# EAGLE design WeMos-Lora (EAGLE 8.1.0)
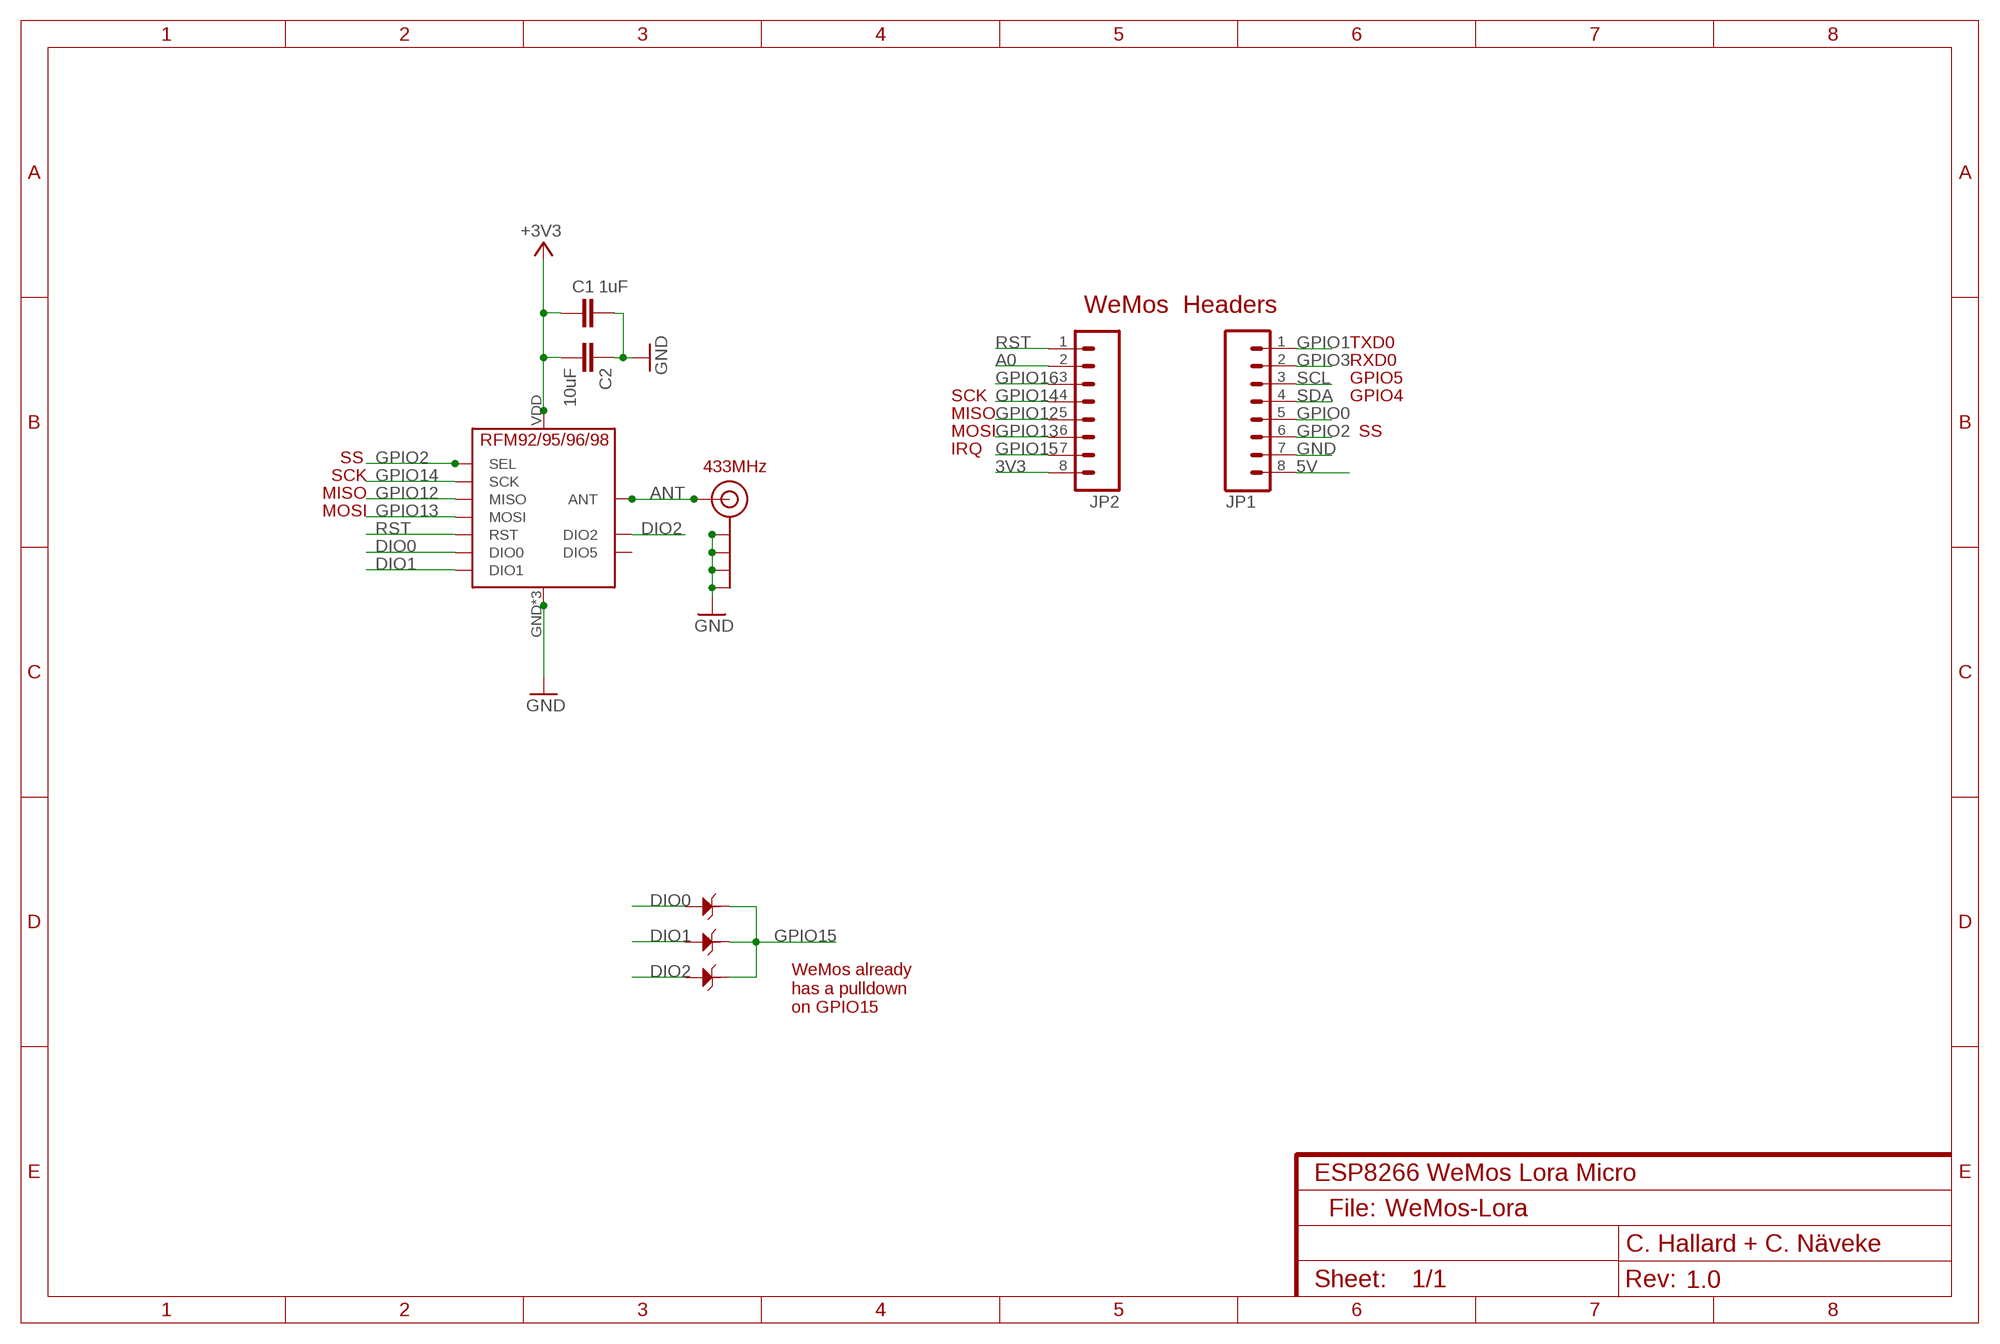
[diagram p0: schematic, sheet 1]
NAME (FRAME-A4L): CNAME: ESP8266 WeMos Lora Micro; CREVISION: 1.0; DESIGNER: C. Hallard + C. Näveke

## Parts
C1  1uF  CAP0805-CAP-LARGEPADS  [0805-CAP-LARGEPADS]
C2  10uF  CAP0805-CAP-LARGEPADS  [0805-CAP-LARGEPADS]
D2  1N4148  D-ESD-2P-CESD5V0D1  [SOD123-2.7X1.6]
D3  1N4148  D-ESD-2P-CESD5V0D1  [SOD123-2.7X1.6]
D4  1N4148  D-ESD-2P-CESD5V0D1  [SOD123-2.7X1.6]
J$2  ANTENNATINY  [SMA_UFL_PAD_TINY]
JP1  M08NO_SILK_FEMALE_PTH  [1X08_NO_SILK]
JP2  M08NO_SILK_FEMALE_PTH  [1X08_NO_SILK]
U$5  RFM95  [RFM95]

## Nets
3V3: C1.2 C2.2 JP2.8 U$5.VDD(VCC) ; supply symbol labelled +3V3
5V: JP1.8
A0: JP2.2
ANT: J$2.ANT1(SIGNAL) J$2.ANT2(SIGNAL) J$2.ANT3(SIGNAL) U$5.ANT
DIO0: D2.1 U$5.DIO0
DIO1: D3.1 U$5.DIO1
DIO2: D4.1 U$5.DIO2
GND: C1.1 C2.1 J$2.GND1(GND) J$2.GND2(GND) J$2.GND3(GND) J$2.GND4(GND) JP1.7 U$5.GND U$5.GND1(GND) U$5.GND2(GND)
GPIO0: JP1.5
GPIO1: JP1.1
GPIO2: JP1.6 U$5.NSS(SEL)
GPIO3: JP1.2
GPIO12: JP2.5 U$5.MISO
GPIO13: JP2.6 U$5.MOSI
GPIO14: JP2.4 U$5.SCK
GPIO15: D2.2 D3.2 D4.2 JP2.7
GPIO16: JP2.3
RST: JP2.1 U$5.RST
SCL: JP1.3
SDA: JP1.4
Unconnected: U$5.DIO5

## Notes on the sheet
- WeMos  Headers
- TXD0
- RXD0
- GPIO5
- SCK | GPIO4
- MISO
- MOSI | SS
- IRQ
- SS
- 433MHz
- SCK
- MISO
- MOSI
- WeMos already
  has a pulldown
  on GPIO15
- File:

## Library data of the parts
C1 C2 = _c2h:CAP: Capacitor Standard 0603 ceramic capacitor, and 0.1" leaded capacitor.
D2-D4 = Seeed-Discrete:D-ESD-2P: Diodes for Protectiong against ESD
J$2 = _c2h:ANTENNA: SMA Antenna Connector End launch SMA connector. The paste layer has been removed so that the connector can be hand soldered onto the board after reflow.
JP1 JP2 = SparkFun-Connectors:M08: Header 8 Standard 8-pin 0.1" header. Use with straight break away headers (SKU : PRT-00116), right angle break away headers (PRT-00553), swiss pins (PRT-00743), machine pins (PRT-00117), and female headers (PRT-00115).; PROD_ID: CONN-08438
U$5 = _c2h:RFM95

## Net classes
0 default: width 0.203 mm, drill 0.356 mm, clearance 0.152 mm
1 power: width 0.203 mm, clearance 0.152 mm

## Board
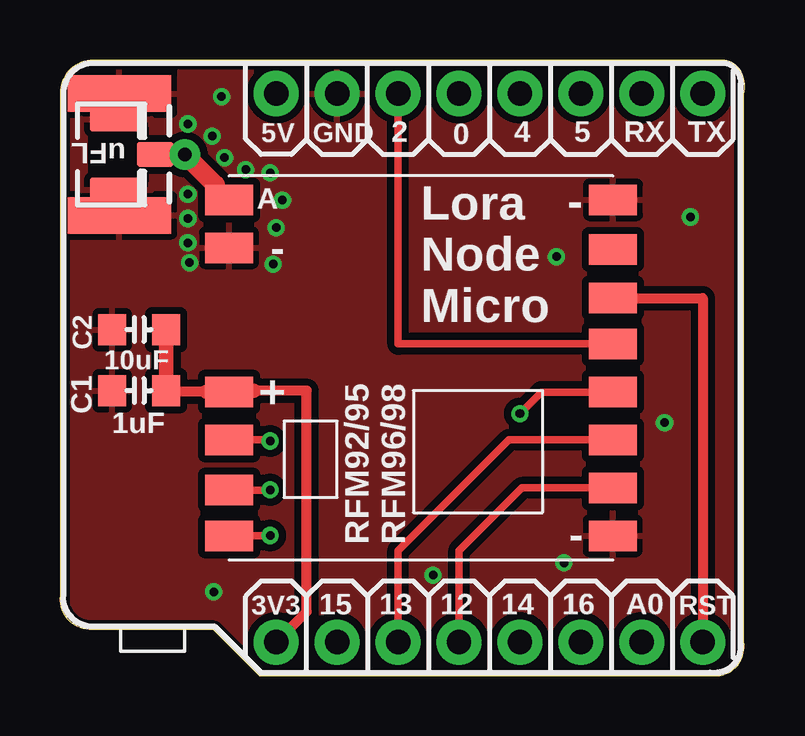
[diagram p1: board, top side]
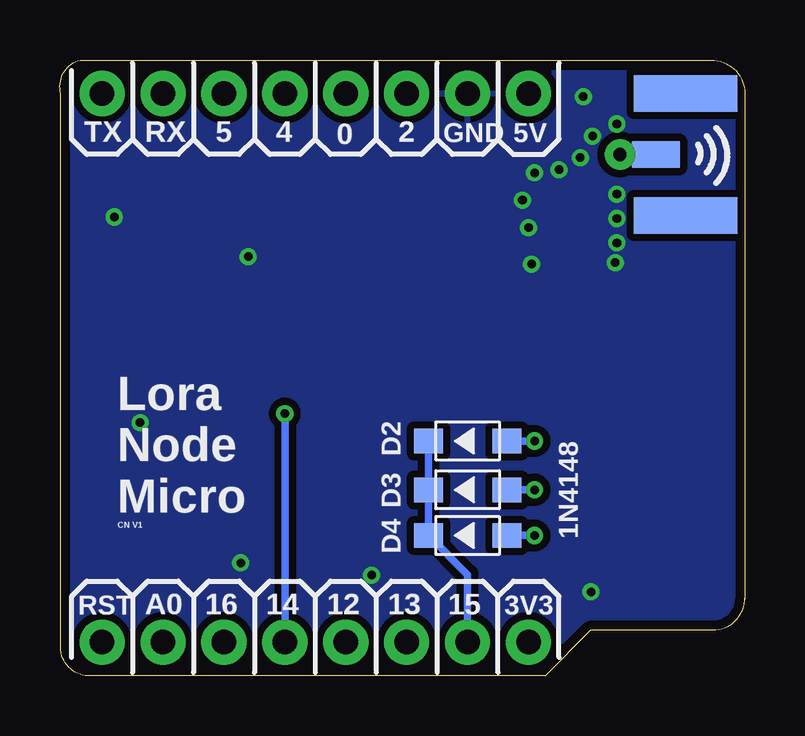
[diagram p2: board, bottom side, seen from below]

Size 28.55 x 25.65 mm. Coordinates in mm from the lower left corner, seen from the top.
Outline: 1.4,25.65 27.72,25.65 arc-90 28.51,24.26 28.51,1.4 arc-90 27.5,0 8.32,0 6.41,1.91 1.33,1.91 arc-90 0,3.24
Outline: 1.4,25.65 1.37,25.65
Outline: 0,3.24 0,24.26 arc-90 1.4,25.65
Outline: 0,3.24 0,3.17
Copper layers (1*16): Top 0.0356mm / dielectric 1.5011mm / Bottom 0.0356mm
Design rules "PCBs_io *": minimum track width 6mil, minimum drill 13mil, track to track 6mil, track to pad 6mil, pad to pad 6mil, via to via 6mil, smd to smd 6mil, copper to edge 15mil, drill to drill 6mil, minimum pad ring 7mil, minimum via ring 7mil, stop-mask expansion 3mil, vias tented up to drill 40mil, thermal gap 10mil

### Footprints (pad centres in the part's own frame; a part is rotated, then mirrored left to right if it is on the bottom)
0805-CAP-LARGEPADS = smd 1.156 x 1.3: 1 -1.127,0; 2 1.127,0
SOD123-2.7X1.6 = smd 1.2 x 1.02: 1 -1.635,0; 2 1.635,0
SMA_UFL_PAD_TINY = smd 1.524 x 1.016: ANT1 -3.843,0 | drill 0.559 pad 1.27: ANT2 -5.08,0 | smd 2.032 x 1.143 bottom: ANT3 -3.589,0 | smd 2.2 x 1.016: GND1 -2.223,1.47; GND2 -2.223,-1.47 | smd 4.318 x 1.524: GND3 -2.349,-2.54; GND4 -2.349,2.54 | smd 4.318 x 1.524 bottom: GND5 -2.349,2.54; GND6 -2.349,-2.54
1X08_NO_SILK = drill 1.016 pad 1.88: 1 0,0; 2 2.54,0; 3 5.08,0; 4 7.62,0; 5 10.16,0; 6 12.7,0; 7 15.24,0; 8 17.78,0
RFM95 = smd 2 x 1.27: ANT 5.777,-7; DIO0 5.777,3; DIO1 5.779,5.095; DIO2 5.779,7; DIO5 -10.225,-4.936; GND 5.777,-5; GND1 -10.223,7; GND2 -10.23,-7; MISO -10.23,5; MOSI -10.225,3; NSS -10.223,-1; RST -10.223,-2.905; SCK -10.23,1.012; VDD 5.777,1

### Placement (x,y rotation side)
C1  3.3,11.87 0 top
C2  3.3,14.41 0 top
D2  11.56,9.78 180 bottom
D3  11.56,7.75 180 bottom
D4  11.56,5.84 180 bottom
J$2  0.13,21.72 180 top
JP1  26.8,24.26 180 top
JP2  26.8,1.4 180 top
U$5  12.83,12.83 180 top

### Tracks (layer width: path | path; a pad name or v marks a point on that pad's centre or on a via)
3V3
  Top 0.406: JP2.8 10.29,2.67 10.29,11.88 7.05,11.88 U$5.VDD 4.43,11.83 C1.2
  Top 0.61: 8.06,11.88 6.11,11.83 U$5.VDD | C1.2 C2.2
ANT
  Top 0.61: U$5.ANT 6.46,19.83 | J$2.ANT1 J$2.ANT2
  Top 0.813: 6.46,19.83 6.46,20.46 J$2.ANT2
  Bottom 0.61: J$2.ANT3 J$2.ANT2
DIO0  (via drill 0.36 pad 0.61)
  Top 0.305: U$5.DIO0 8.71,9.83 v8.76,9.78
  Bottom 0.305: D2.1 v8.76,9.78
DIO1  (via drill 0.36 pad 0.61)
  Top 0.305: 7.03,7.75 U$5.DIO1 8.75,7.73 v8.76,7.75
  Bottom 0.305: D3.1 v8.76,7.75
DIO2  (via drill 0.36 pad 0.61)
  Top 0.305: U$5.DIO2 8.75,5.83 v8.76,5.84
  Bottom 0.305: D4.1 v8.76,5.84
GND  (via drill 0.36 pad 0.71)
  other vias: 25.21,10.54 6.41,3.49 6.73,24.13 9.27,19.81 8.89,17.14 6.35,22.48 6.86,21.59 5.33,20.07 5.33,19.05 5.33,18.03 5.33,22.99 15.56,4.19 21.02,4.7 26.29,19.11 7.75,21.08 8.76,20.95 9.02,18.67 5.4,17.21 20.7,17.46
  pour Bottom (isolate 0.305): 29.65,26.8 29.65,-1.14 -1.14,-1.14 -1.14,26.8
  pour Top (isolate 0.305): -0.51,26.16 29.02,26.16 29.02,-0.51 -0.51,-0.51
GPIO2
  Top 0.305: 23.05,13.78 U$5.NSS 14.1,13.83 JP1.6
GPIO12
  Top 0.305: JP2.5 16.64,5.21 19.26,7.83 U$5.MISO
GPIO13
  Top 0.305: JP2.6 14.1,5.21 18.72,9.83 U$5.MOSI
GPIO14  (via drill 0.36 pad 0.71)
  Top 0.305: U$5.SCK 20.07,11.82 v19.18,10.92
  Bottom 0.305: v19.18,10.92 JP2.4
GPIO15
  Bottom 0.305: D2.2 D3.2 D4.2 11.56,4.21 JP2.7
RST
  Top 0.406: U$5.RST 26.8,15.73 JP2.1

### Text on the board
tNames: 5V | GND | 2 | 0 | 4 | 5 | RX | TX | Lora / Node / Micro | RFM92/95 / RFM96/98 | 3V3 | 15 | 13 | 12 | 14 | 16 | A0 | RST
bNames: 5V | GND | 2 | 0 | 4 | 5 | RX | TX | Lora / Node / Micro | CN V1 | 3V3 | 15 | 13 | 12 | 14 | 16 | A0 | RST